# EAGLE design controller (EAGLE 9.6.2)
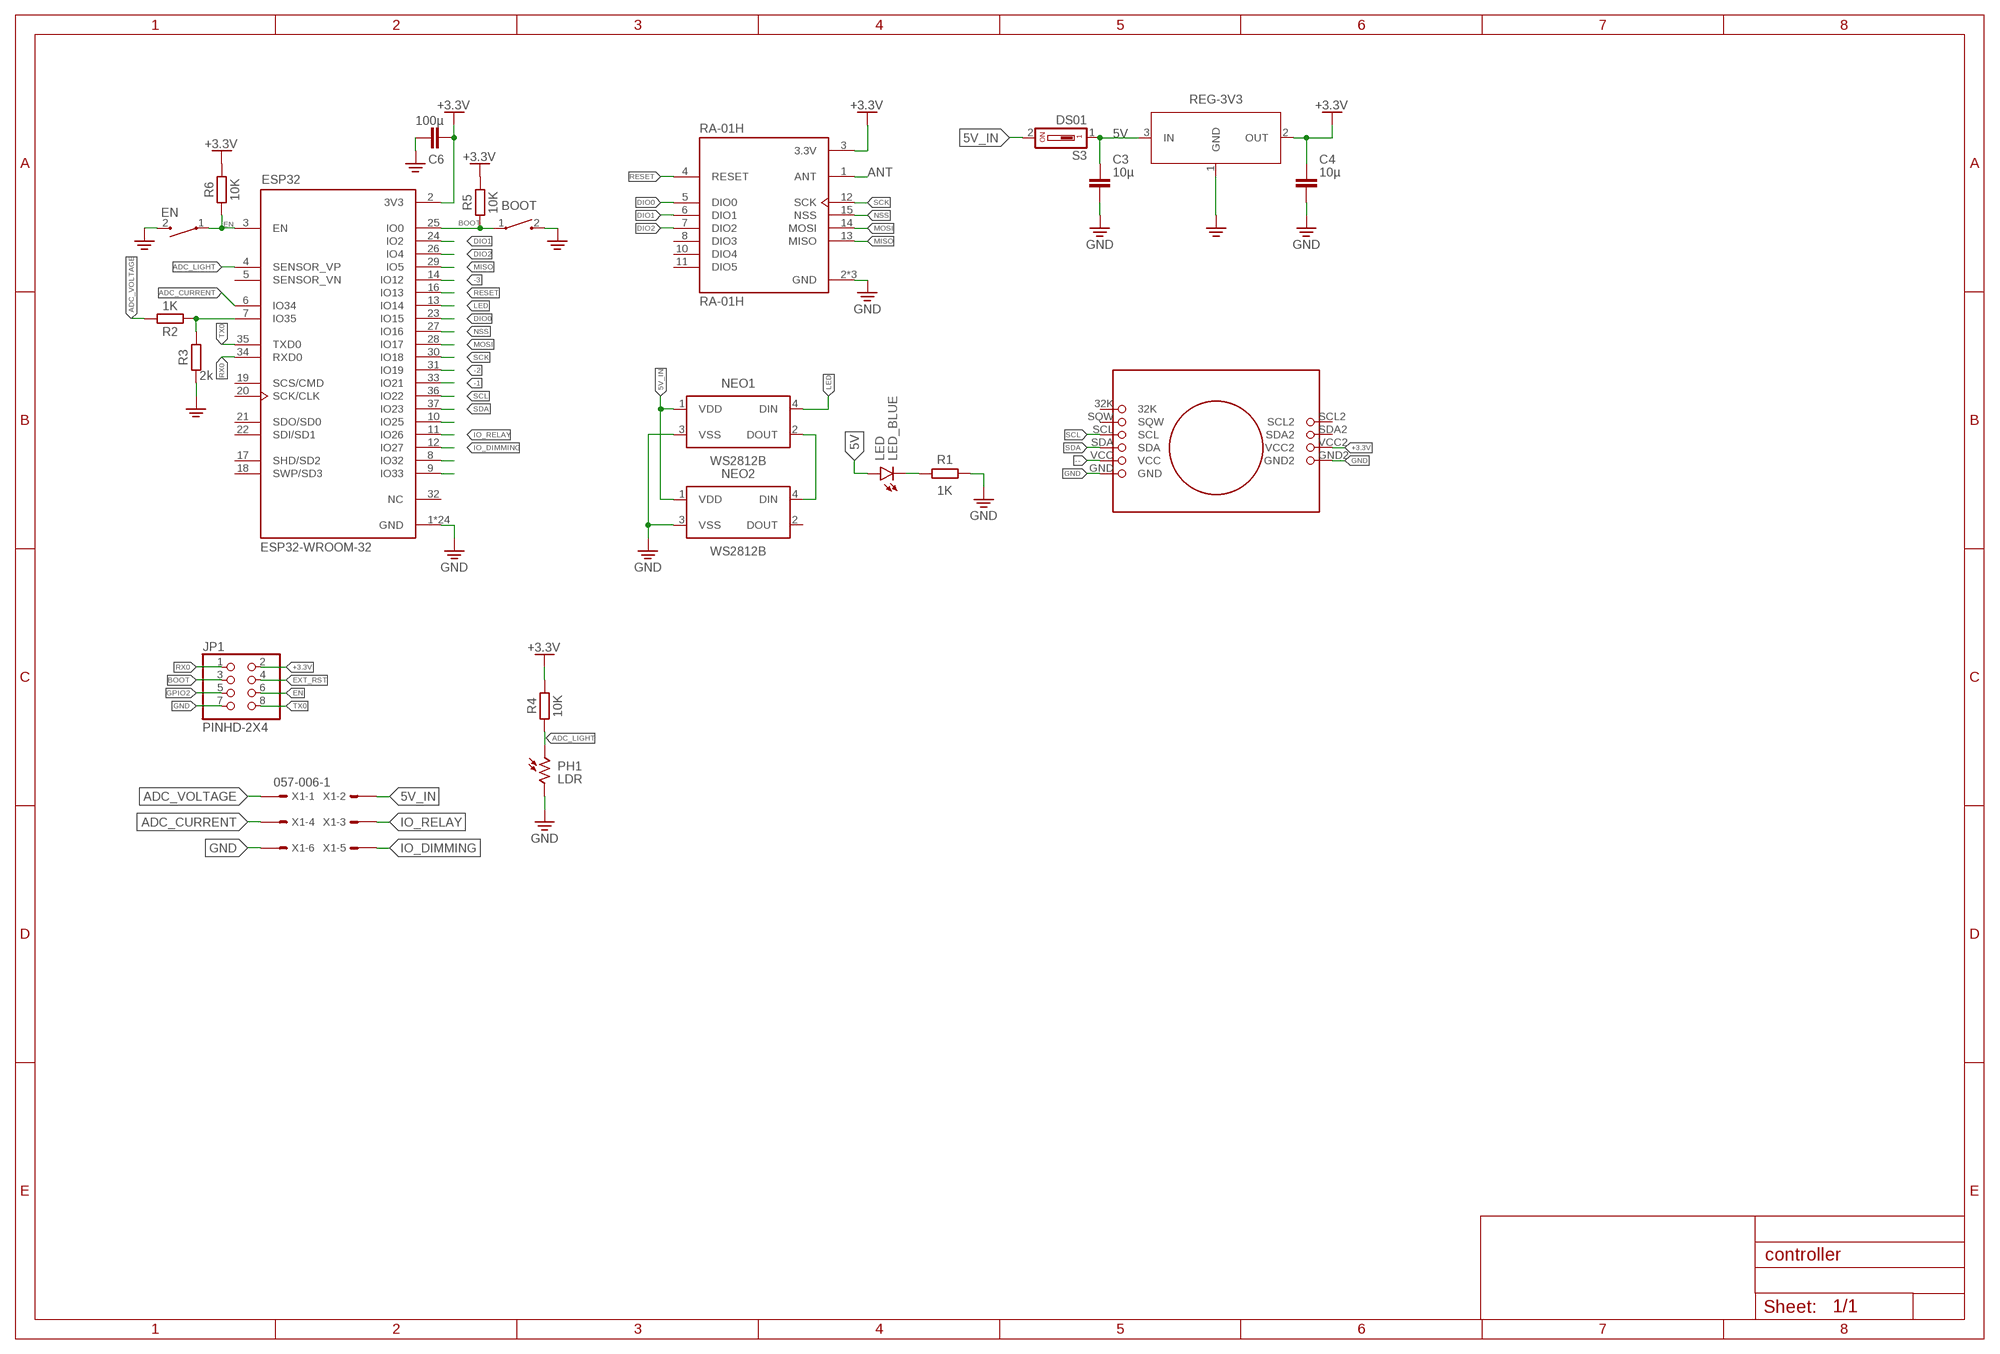
[diagram p0: schematic, sheet 1]

## Parts
BOOT  SWITCH  [SW_1437566-3]
C3  10µ  C_CHIP-0805(2012-METRIC)  [CAPC2012X110]
C4  10µ  C_CHIP-0805(2012-METRIC)  [CAPC2012X110]
C6  100µ  C_TANTALUM-2412(6032-METRIC)  [CAPM6032X280]
EN  SWITCH  [SW_1437566-3]
ESP32  ESP32-WROOM-32  [MODULE_ESP32-WROOM-32]
JP1  PINHD-2X4  [2X04]
LED  LED_BLUE  CHIP-FLAT-B_0805  [LEDC2012X110N_FLAT-B]
NEO1  WS2812B  [WS2812B]
NEO2  WS2812B  [WS2812B]
PH1  LDR  A1050_09  [T0-46-A10XX]
R1  1K  R_CHIP-0805(2012-METRIC)  [RESC2012X65]
R2  1K  R_CHIP-0805(2012-METRIC)  [RESC2012X65]
R3  2k  R_CHIP-0805(2012-METRIC)  [RESC2012X65]
R4  10K  R_CHIP-0603(1608-METRIC)  [RESC1608X60]
R5  10K  R_CHIP-0805(2012-METRIC)  [RESC2012X65]
R6  10K  R_CHIP-0805(2012-METRIC)  [RESC2012X65]
RA-01H  RA-01H  [RA-01H]
REG-3V3  NCP1117ST33T3G  NCP1117ST33T3GSOT-223  [SOT230P700X170-4]
S3  DS01  [DS-01]
U$1  DS3231_MODULE  [DS3231_MODULE]
X1  057-006-1  [057-006-1]

## Nets
5V: C3.1 LED.A REG-3V3.3(IN) S3.1
5V_IN: NEO1.1(VDD) NEO2.1(VDD) S3.2 X1.2
+3.3V: C4.1 C6.1 ESP32.2(3V3) JP1.2 R4.2 R5.2 R6.2 RA-01H.3(3.3V) REG-3V3.2(OUT) U$1.VCC2
-1: ESP32.33(IO21)
-2: ESP32.31(IO19)
-3: ESP32.14(IO12)
--: U$1.VCC
ADC_CURRENT: ESP32.6(IO34) X1.4
ADC_LIGHT: ESP32.4(SENSOR_VP) PH1.1 R4.1
ADC_VOLTAGE: R2.2 X1.1
ANT: RA-01H.1(ANT)
BOOT: BOOT.1 ESP32.25(IO0) JP1.3 R5.1
DIO0: ESP32.23(IO15) RA-01H.5(DIO0)
DIO1: ESP32.24(IO2) RA-01H.6(DIO1)
DIO2: ESP32.26(IO4) RA-01H.7(DIO2)
EN: EN.1 ESP32.3(EN) JP1.6 R6.1
EXT_RST: JP1.4
GND: BOOT.2 C3.2 C4.2 C6.2 EN.2 ESP32.1(GND) ESP32.15(GND) ESP32.38(GND) ESP32.39_1(GND) ESP32.39_2(GND) ESP32.39_3(GND) ESP32.39_4(GND) ESP32.39_5(GND) ESP32.39_6(GND) ESP32.39_7(GND) ESP32.39_8(GND) ESP32.39_9(GND) ESP32.39_10(GND) ESP32.39_11(GND) ESP32.39_12(GND) ESP32.39_13(GND) ESP32.39_14(GND) ESP32.39_15(GND) ESP32.39_16(GND) ESP32.39_17(GND) ESP32.39_18(GND) ESP32.39_19(GND) ESP32.39_20(GND) ESP32.39_21(GND) JP1.7 NEO1.3(VSS) NEO2.3(VSS) PH1.2 R1.2 R3.1 RA-01H.2(GND) RA-01H.9(GND) RA-01H.16(GND) REG-3V3.1(GND) U$1.GND U$1.GND2 X1.6
GPIO2: JP1.5
IO_DIMMING: ESP32.12(IO27) X1.5
IO_RELAY: ESP32.11(IO26) X1.3
LED: ESP32.13(IO14) NEO1.4(DIN)
MISO: ESP32.29(IO5) RA-01H.13(MISO)
MOSI: ESP32.28(IO17) RA-01H.14(MOSI)
N$2: ESP32.7(IO35) R2.1 R3.2
N$14: NEO1.2(DOUT) NEO2.4(DIN)
N$25: LED.C R1.1
N$42: ESP32.10(IO25)
N$45: ESP32.8(IO32)
N$46: ESP32.9(IO33)
NSS: ESP32.27(IO16) RA-01H.15(NSS)
RESET: ESP32.16(IO13) RA-01H.4(RESET)
RX0: ESP32.34(RXD0) JP1.1
SCK: ESP32.30(IO18) RA-01H.12(SCK)
SCL: ESP32.36(IO22) U$1.SCL
SDA: ESP32.37(IO23) U$1.SDA
TX0: ESP32.35(TXD0) JP1.8
Unconnected: ESP32.5(SENSOR_VN) ESP32.17(SHD/SD2) ESP32.18(SWP/SD3) ESP32.19(SCS/CMD) ESP32.20(SCK/CLK) ESP32.21(SDO/SD0) ESP32.22(SDI/SD1) ESP32.32(NC) NEO2.2(DOUT) RA-01H.8(DIO3) RA-01H.10(DIO4) RA-01H.11(DIO5) U$1.32K U$1.SCL2 U$1.SDA2 U$1.SQW

## Library data of the parts
BOOT EN = XLKM#4:SWITCH: Switch Tactile OFF (ON) SPST Rectangular Button Gull Wing 0.05A 12VDC SMD Loose Piece; MANUFACTURER: TE CONNECTIVITY; PARTREV: C2; STANDARD: Manufacturer recommendations
C3 C4 C6 = Capacitor:C: Capacitor - Generic; CATEGORY: Capacitor
ESP32 = XLKM#4:ESP32-WROOM-32; MANUFACTURER: Espressif Systems; MAXIMUM_PACKAGE_HEIGHT: 3.2 mm; PARTREV: 2.9; STANDARD: Manufacturer Recommendations
JP1 = Connector:PINHD-2X4: PIN HEADER; CATEGORY: CONNECTOR; SUB-CATEGORY: PIN-HEADER
LED = LED:CHIP-FLAT-B; CATEGORY: LED; COLOR: BLUE; DESCRIPTION: CHIP LED FLAT; SUB-CATEGORY: CHIP; TYPE: FLAT_TOP
NEO1 NEO2 = LED:WS2812B: Intelligent control LED integrated light source Datasheet <http://cdn.sparkfun.com/datasheets/BreakoutBoards/WS2812B.pdf>; CATEGORY: LED; COLOR: RGB; DESCRIPTION: LED integrated light source; MANUFACTURER: Worldsemi; MPN: WS2812B; OPERATING_TEMP: -25 ℃ to +80℃(TJ); PART_STATUS: Active; SUB_CATEGORY: RGB
PH1 = photo-elements:A10: Sensor Robust Light Sensing Applications Outdoor Light Sensing Application Source: http://optoelectronics.perkinelmer.com/content/Datasheets/DTS_PhotocellsA1050.pdf
R1-R6 = Resistor:R: Resistor Fixed - Generic; CATEGORY: Resistor; SUB-CATEGORY: Fixed
RA-01H = XLKM#4:RA-01H: Ai-Thinker Lora Series Module; MANUFACTURER: AI-Thinker; MAXIMUM_PACKAGE_HEIGHT: 3.4mm; PARTREV: V1.0; STANDARD: Manufacturer Recommendations
REG-3V3 = IC_Power-Management:NCP1117ST33T3G: 1.0 A Low-Dropout Positive Fixed and Adjustable Voltage Regulators Datasheet <https://www.onsemi.com/pub/Collateral/NCP1117-D.PDF>; CATEGORY: IC_Power-Management; MANUFACTURER: ON Semiconductor; MPN: NCP1117ST33T3G; OPERATING_TEMP: 0 to +125 °C; PART_STATUS: Active; ROHS_COMPLIANT: RoHS3 Compliant; SERIES: NCP1117, NCV1117; SUB-CATEGORY: Voltage Regulator; TYPE: Linear
S3 = Switch:DS01: DIL/CODE SWITCH; CATEGORY: SWITCH; TYPE: SPST
U$1 = XLKM#4:DS3231_MODULE
X1 = con-panduit:057-006-: CONNECTOR 6-pin series 057 contact pc board low profile headers; OC_FARNELL: unknown; OC_NEWARK: unknown

## Board
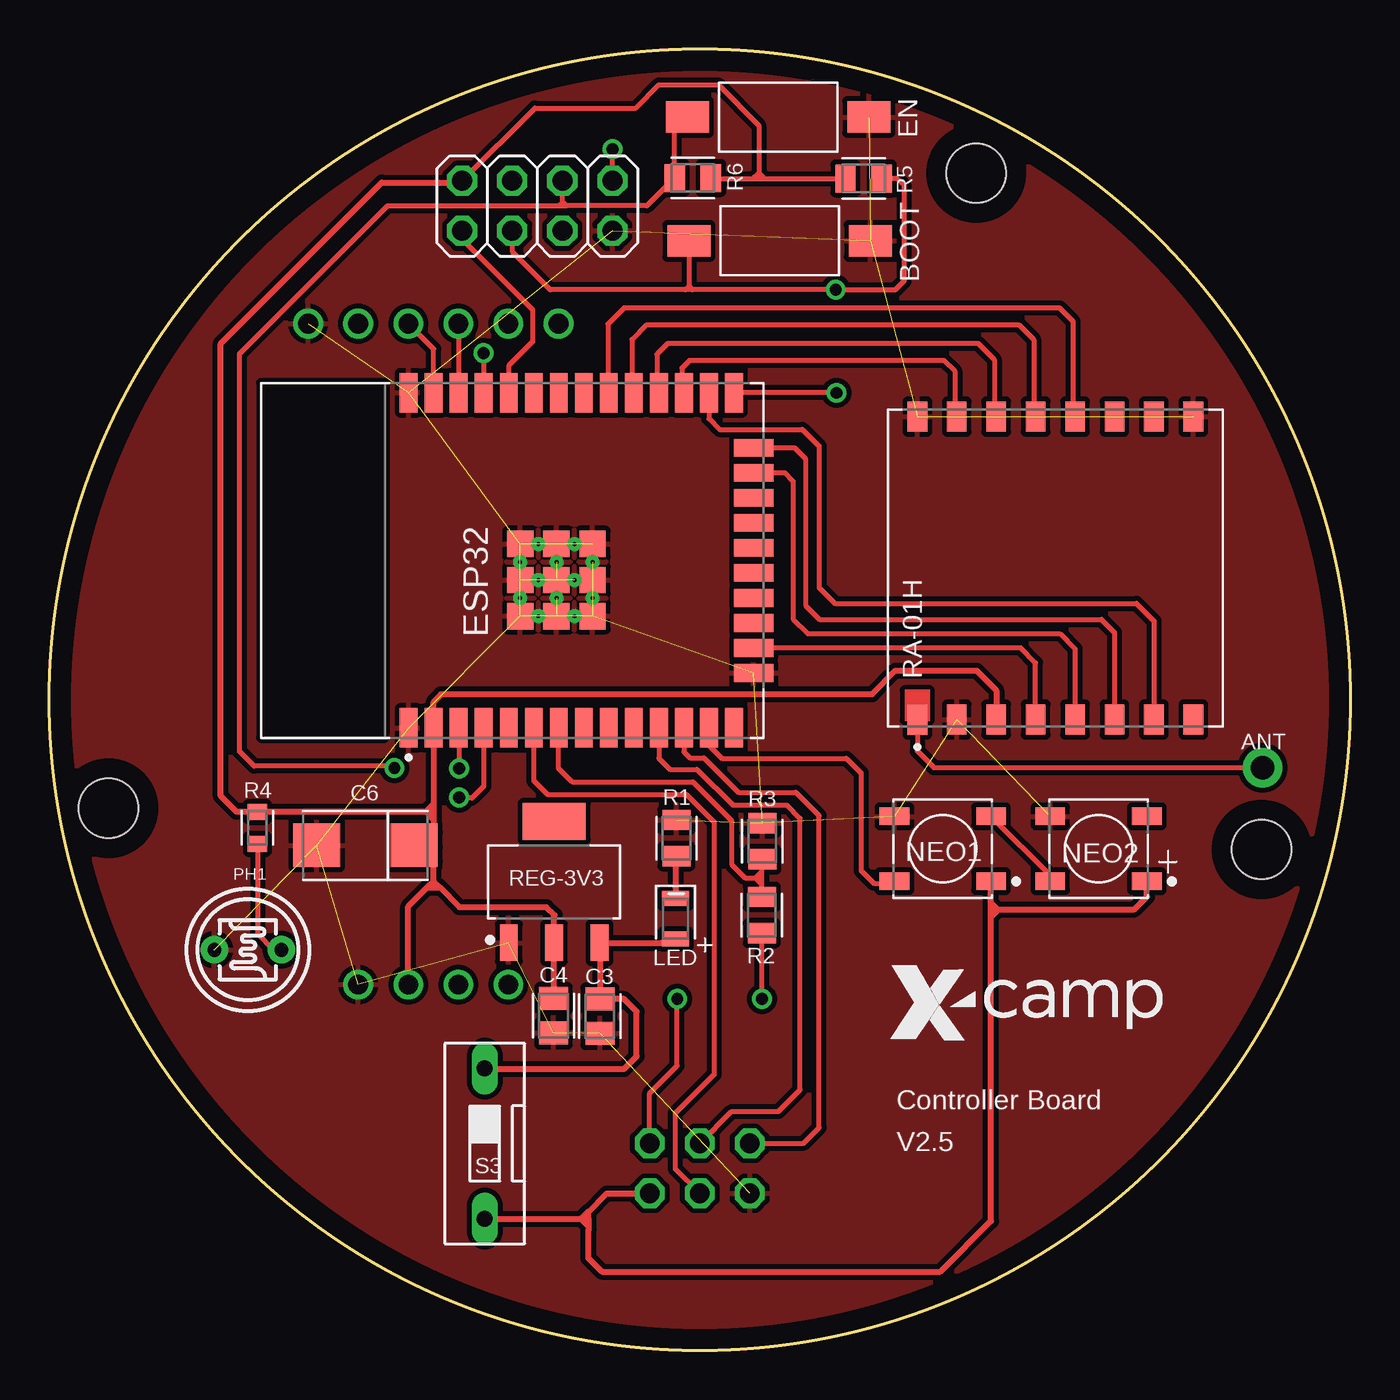
[diagram p1: board, top side]
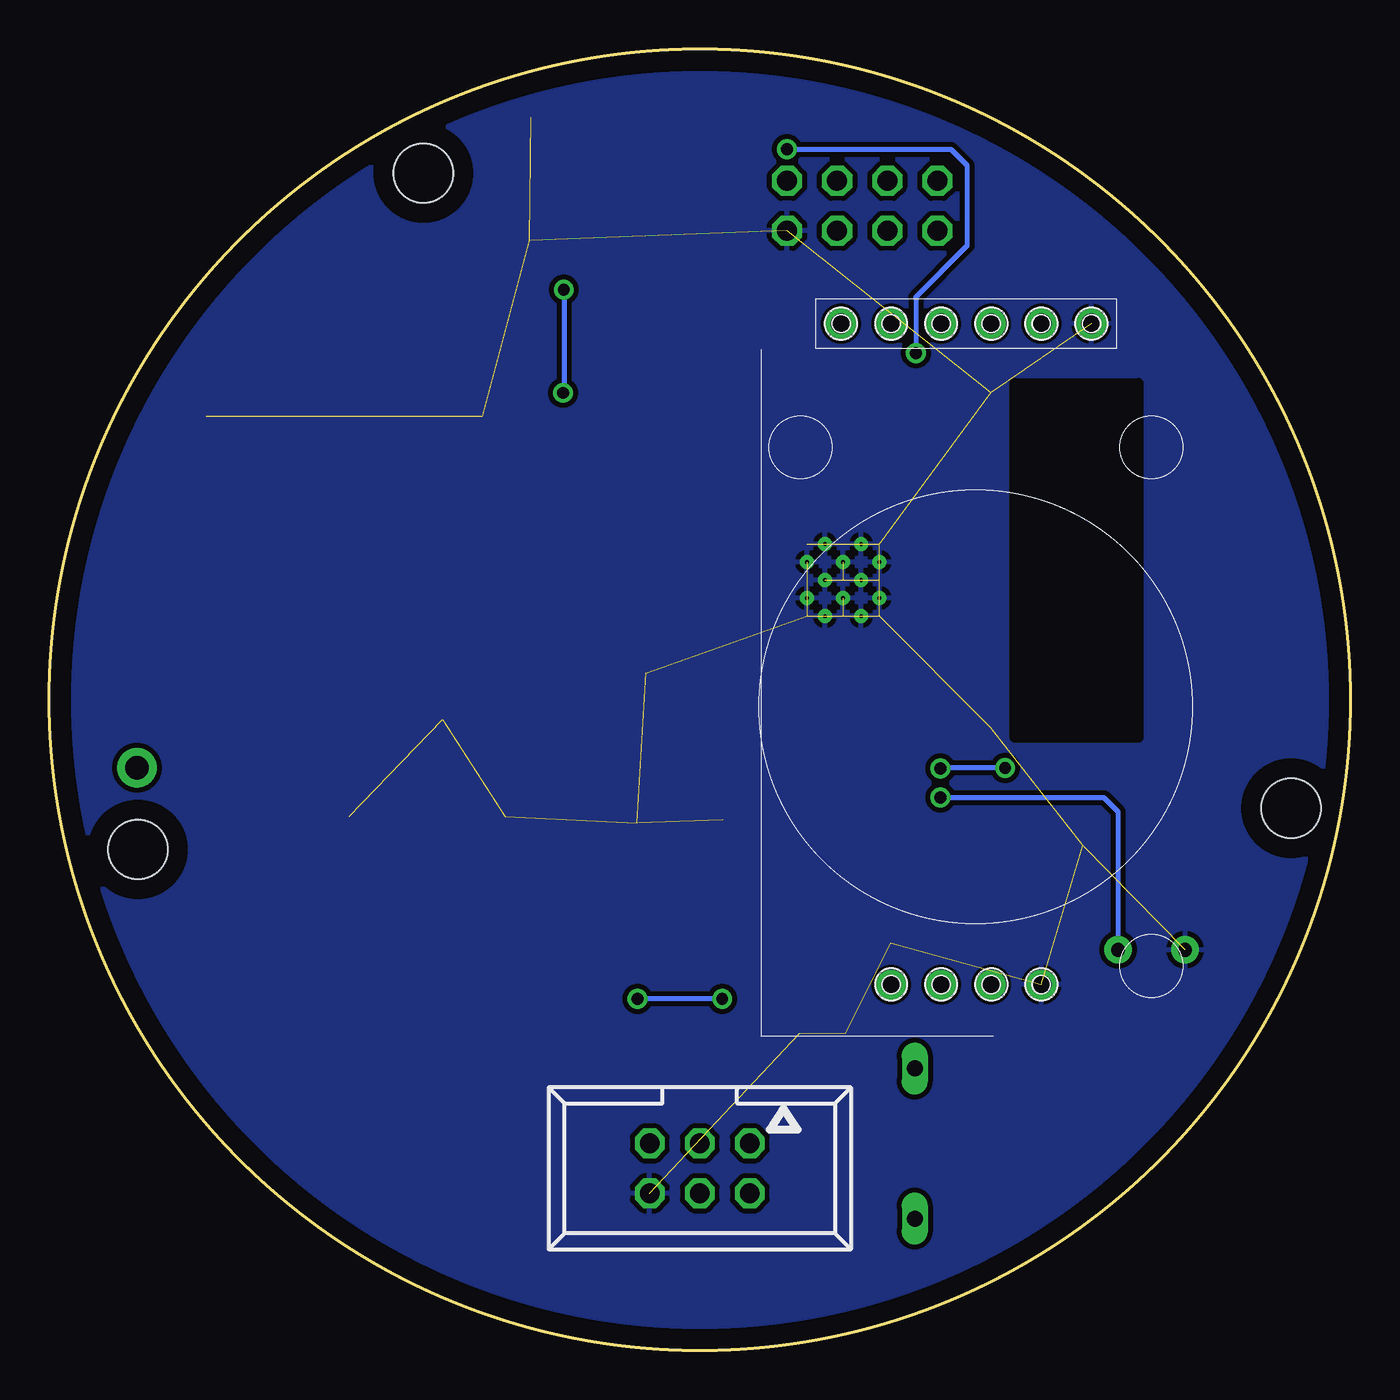
[diagram p2: board, bottom side, seen from below]

Size 66 x 66 mm. Coordinates in mm from the lower left corner, seen from the top.
Outline: circle at 33,33 radius 33
Copper layers (1*16): Top 0.035mm / dielectric 1.5mm / Bottom 0.035mm
Design rules "default *": minimum track width 6mil, minimum drill 0.35mm, track to track 10mil, track to pad 10mil, pad to pad 10mil, via to via 10mil, smd to smd 6mil, copper to edge 40mil, drill to drill 6mil, minimum pad ring 10mil, minimum via ring 8mil, stop-mask expansion 4mil, vias tented up to drill 0mil, thermal gap 10mil
Holes 3 mm at 3,27.5 61.5,25.4 47.02,59.71

### Footprints (pad centres in the part's own frame; a part is rotated, then mirrored left to right if it is on the bottom)
SW_1437566-3 = smd 2.18 x 1.6: 1 -4.6,0; 2 4.6,0
CAPC2012X110 = smd 1.165 x 1.465: 1 -0.875,0; 2 0.875,0
CAPM6032X280 = smd 2.368 x 2.204: 1 -2.471,0; 2 2.471,0
MODULE_ESP32-WROOM-32 = smd 2 x 0.9: 1 -8.5,5.26; 2 -8.5,3.99; 3 -8.5,2.72; 4 -8.5,1.45; 5 -8.5,0.18; 6 -8.5,-1.09; 7 -8.5,-2.36; 8 -8.5,-3.63; 9 -8.5,-4.9; 10 -8.5,-6.17; 11 -8.5,-7.44; 12 -8.5,-8.71; 13 -8.5,-9.98; 14 -8.5,-11.25; 25 8.5,-11.25; 26 8.5,-9.98; 27 8.5,-8.71; 28 8.5,-7.44; 29 8.5,-6.17; 30 8.5,-4.9; 31 8.5,-3.63; 32 8.5,-2.36; 33 8.5,-1.09; 34 8.5,0.18; 35 8.5,1.45; 36 8.5,2.72; 37 8.5,3.99; 38 8.5,5.26 | smd 0.9 x 2: 15 -5.715,-12.25; 16 -4.445,-12.25; 17 -3.175,-12.25; 18 -1.905,-12.25; 19 -0.635,-12.25; 20 0.635,-12.25; 21 1.905,-12.25; 22 3.175,-12.25; 23 4.445,-12.25; 24 5.715,-12.25 | smd 1.33 x 1.33: 39_1 -2.835,-0.405; 39_2 -1,-0.405; 39_3 0.835,-0.405; 39_4 -2.835,-2.24; 39_5 -1,-2.24; 39_6 0.835,-2.24; 39_7 -2.835,-4.075; 39_8 -1,-4.075; 39_9 0.835,-4.075 | drill 0.2 pad 0.3: 39_10 -1.917,-0.405; 39_11 -0.083,-0.405; 39_12 -2.835,-1.323; 39_13 -1,-1.323; 39_14 0.835,-1.323; 39_15 -1.917,-2.24; 39_16 -0.083,-2.24; 39_17 -2.835,-3.158; 39_18 -1,-3.158; 39_19 0.835,-3.158; 39_20 -1.917,-4.075; 39_21 -0.083,-4.075
2X04 = drill 1.016 octagon: 1 -3.81,-1.27; 2 -3.81,1.27; 3 -1.27,-1.27; 4 -1.27,1.27; 5 1.27,-1.27; 6 1.27,1.27; 7 3.81,-1.27; 8 3.81,1.27
LEDC2012X110N_FLAT-B = smd 0.762 x 1.362: A 1.025,0; C -1.025,0
WS2812B = smd 1.5 x 0.9: 1 -2.45,1.65; 2 -2.45,-1.65; 3 2.45,-1.65; 4 2.45,1.65
T0-46-A10XX = drill 0.7 pad 1.4: 1 -1.7,0; 2 1.7,0
RESC2012X65 = smd 1.031 x 1.42: 1 -0.919,0; 2 0.919,0
RESC1608X60 = smd 0.799 x 0.974: 1 -0.815,0; 2 0.815,0
RA-01H = smd 1.536 x 1: 1 -7.682,7; 2 -7.682,5; 3 -7.682,3; 4 -7.682,1; 5 -7.682,-1; 6 -7.682,-3; 7 -7.682,-5; 8 -7.682,-7; 9 7.682,-7; 10 7.682,-5; 11 7.682,-3; 12 7.682,-1; 13 7.682,1; 14 7.682,3; 15 7.682,5; 16 7.682,7
SOT230P700X170-4 = smd 1.86 x 0.898: 1 -3.075,2.3; 2 -3.075,0; 3 -3.075,-2.3 | smd 1.86 x 3.189: 4 3.075,0
DS-01 = drill 0.813 long: 1 0,-3.81; 2 0,3.81
DS3231_MODULE = drill 1: 32K -4.108,36.06; GND -16.808,36.06; GND2 -14.268,2.532; SCL -9.188,36.06; SCL2 -6.648,2.532; SDA -11.728,36.06; SDA2 -9.188,2.532; SQW -6.648,36.06; VCC -14.268,36.06; VCC2 -11.728,2.532
057-006-1 = drill 1 octagon: 1 -2.54,-1.27; 2 -2.54,1.27; 3 0,-1.27; 4 0,1.27; 5 2.54,-1.27; 6 2.54,1.27

### Placement (x,y rotation side)
BOOT  37.05,56.28 0 top
C3  27.93,16.94 270 top
C4  25.58,16.97 270 top
C6  16.04,25.61 180 top
EN  36.98,62.57 0 top
ESP32  23.49,40.07 90 top
JP1  24.76,58.06 0 top
LED  31.77,21.88 270 top
NEO1  45.33,25.44 180 top
NEO2  53.23,25.44 180 top
PH1  10.08,20.31 180 top
R1  31.82,25.98 90 top
R2  36.15,22.08 270 top
R3  36.17,25.82 270 top
R4  10.56,26.5 90 top
R5  41.31,59.45 180 top
R6  32.65,59.47 0 top
RA-01H  51.04,39.68 90 top
REG-3V3  25.61,23.75 90 top
S3  22.09,10.48 180 top
U$1  29.94,16.02 0 top
X1  33,9.23 180 bottom

### Tracks (layer width: path | path; a pad name or v marks a point on that pad's centre or on a via)
5V
  Top 0.152: LED.A 31.58,20.68 31.06,20.68
  Top 0.305: 31.22,20.68 31.06,20.68 REG-3V3.3 27.93,20.66 C3.1 29.17,17.82 29.8,17.19 29.8,14.91 29.15,14.27 22.12,14.27 S3.1
5V_IN
  Top 0.254: 27.35,7.03 27.3,7.03 26.94,6.67 27.35,6.27 27.35,6.09
  Top 0.305: NEO2.1 55.68,23.01 55.02,22.34 48.13,22.34 | S3.2 26.94,6.67 27.32,6.67 27.35,6.7 | 47.78,21.99 47.78,6.55 45.2,3.98 28.03,3.98 27.35,4.67 27.35,6.09 27.35,6.7 | 47.78,21.99 47.78,22.7 | 48.13,22.34 47.78,22.7 | 48.13,22.34 47.78,21.99 | 27.35,6.7 27.35,7.03 28.28,7.96 X1.2 | 47.78,22.7 NEO1.1
+3.3V
  Top 0.152: 19.54,24.81 19.5,24.81
  Top 0.254: JP1.2 24.64,63.02 29.76,63.02 30.93,64.19 33.94,64.19 36,62.13 36,59.72 35.69,59.41 | 35.69,59.41 33.62,59.41 R6.2 | R5.2 40.36,59.41 36.31,59.41 | 36.31,59.41 35.69,59.41 | 36,59.71 36.31,59.41
  Top 0.305: 25.61,22.07 REG-3V3.2 25.61,17.88 C4.1 | 25.61,22.07 25.21,22.48 20.81,22.48 19.81,23.47 | 19.81,23.47 19.5,23.79 | 19.5,23.79 19.5,24.81 | 25.61,22.07 25.64,22.07 | C6.1 19.5,25.53 19.5,26.93 | RA-01H.3 48.04,33.48 47.04,34.48 42.94,34.48 41.74,33.28 19.88,33.28 19.5,32.9 ESP32.2 19.5,27.71 | U$1.VCC2 18.21,22.5 19.18,23.47 | 19.18,23.47 19.5,23.79 | 19.18,23.47 19.81,23.47 | 19.5,27.71 19.5,27.32 | 19.5,27.32 19.5,26.93 | 19.5,27.32 19.11,27.32 | 19.11,27.32 10.57,27.32 R4.2 9.5,27.31 8.7,28.11 8.7,51.07 16.87,59.24 21.11,59.24 21.02,59.33 JP1.2 | 19.11,27.32 19.5,27.71 | 19.11,27.32 19.5,26.93
  Top 0.406: 19.5,24.81 19.5,25.53 | 19.5,26.25 C6.1
ADC_CURRENT
  Top 0.254: ESP32.6 24.58,28.9 25.28,28.2 32.33,28.2 33.72,26.8 33.72,13.99 31.77,12.03 31.77,9.19 X1.4
ADC_LIGHT  (via drill 0.6 pad 1)
  Top 0.254: ESP32.4 22.04,28.6 21.44,28.01 20.82,28.01 v20.8,28.03 | R4.1 10.56,21.14 11.38,20.31 PH1.1
  Bottom 0.254: v20.8,28.03 12.49,28.03 11.78,27.32 PH1.1
ADC_VOLTAGE  (via drill 0.6 pad 1)
  Top 0.254: v36.15,17.82 R2.2 | X1.1 30.46,13.04 31.86,14.43 v31.86,17.82
  Bottom 0.254: v31.86,17.82 v36.15,17.82
ANT  (via drill 1.2 pad 2)
  Top 0.254: RA-01H.1 44.04,30.39 44.87,29.56 v61.55,29.56
BOOT  (via drill 0.6 pad 1)
  Top 0.152: ESP32.25 34.74,49.4
  Top 0.254: JP1.3 23.49,55.73 25.42,53.8 32.26,53.8 | 32.63,53.8 v39.9,53.8 42.92,53.8 43.38,54.26 43.38,59.07 43,59.45 R5.1 | 32.63,53.8 32.26,53.8 | v39.93,48.57 34.82,48.57 34.78,48.53 | BOOT.1 32.45,53.99 | 32.45,53.99 32.45,53.98 32.63,53.8 | 32.26,53.8 32.45,53.99
  Top 0.305: 34.78,48.53 ESP32.25
  Bottom 0.254: v39.9,53.8 39.9,48.61 v39.93,48.57
DIO0
  Top 0.254: ESP32.23 37.3,44.52 37.74,44.08 37.74,37.1 38.48,36.36 51.26,36.36 52.04,35.58 RA-01H.5
DIO1
  Top 0.152: RA-01H.6 54.14,32.1
  Top 0.254: ESP32.24 37.81,45.79 38.37,45.23 38.37,37.78 39.07,37.08 53.38,37.08 54.04,36.42 RA-01H.6
DIO2
  Top 0.254: ESP32.26 33.47,47.25 34,46.72 38.2,46.72 39.05,45.87 39.05,38.69 39.86,37.88 55.15,37.88 56.04,36.99 RA-01H.7
EN  (via drill 0.6 pad 1)
  Top 0.254: 25.84,58.06 17.16,58.06 9.66,50.55 9.66,30.37 10.39,29.63 17.4,29.63 v17.51,29.53 | 25.84,58.06 26.03,58.25 | ESP32.3 20.78,31.56 v20.78,29.52 | 26.22,58.06 30.32,58.06 R6.1 31.73,61.92 EN.1 | 26.22,58.06 26.03,58.25 | 26.03,58.25 JP1.6 | 25.84,58.06 26.22,58.06
  Bottom 0.254: v17.51,29.53 20.77,29.53 v20.78,29.52
GND  (41 unrouted)
  pour Top (isolate 0.254): -0.41,46.6 19.37,66.39 46.65,66.39 66.49,46.55 66.49,19.37 46.8,-0.31 19.16,-0.31 -0.41,19.26
  pour Bottom (isolate 0.254): -0.41,46.56 19.37,66.35 46.65,66.35 66.49,46.51 66.49,19.33 46.8,-0.35 19.16,-0.35 -0.41,19.22
IO_DIMMING
  Top 0.254: ESP32.12 32.2,30.36 32.51,30.05 33.2,30.05 34.96,28.3 37.88,28.3 38.84,27.34 39.06,27.12 39.06,11.28 38.27,10.5 X1.5
IO_RELAY
  Top 0.254: ESP32.11 30.93,30.03 31.49,29.47 32.86,29.47 34.68,27.65 37.42,27.65 38.09,26.98 38.09,13.21 36.99,12.11 34.61,12.11 X1.3
LED
  Top 0.152: 42.78,23.69 NEO1.4 | ESP32.13 33.44,31.54
  Top 0.254: ESP32.13 33.47,30.68 34.12,30.03 40.44,30.03 41.18,29.29 41.18,24.34 41.83,23.69 42.78,23.69
MISO
  Top 0.152: RA-01H.13 49.94,47.46 | 29.56,48.67 ESP32.29
  Top 0.254: 49.94,47.46 49.94,51.27 49.22,51.99 30.27,51.99 29.56,51.28 29.56,48.67
MOSI
  Top 0.152: RA-01H.14 47.94,47.46 | 30.83,48.67 ESP32.28
  Top 0.254: 47.94,47.46 47.94,50.26 47.13,51.07 31.37,51.07 30.83,50.53 30.83,48.67
N$2
  Top 0.254: R2.1 36.15,23.64 | 36.15,23.64 36.15,23.97 | 36.15,23.97 36.15,24.27 | 36.15,24.27 36.15,24.98 R3.2 36.17,24.76 | ESP32.7 25.85,29.51 26.52,28.83 32.66,28.83 34.61,26.88 34.61,24.66 35.3,23.97 35.83,23.97 | 36.15,23.97 35.83,23.97 | 35.83,23.97 36.14,24.27 36.15,24.27 | 35.83,23.97 35.83,23.96 36.15,23.64
N$14
  Top 0.254: NEO1.2 50.78,24.09 NEO2.4
N$25
  Top 0.305: R1.1 31.77,25.01 LED.C
NSS
  Top 0.152: RA-01H.15 45.94,47.46 | 32.1,48.67 ESP32.27
  Top 0.254: 45.94,47.46 45.94,49.67 45.4,50.22 32.48,50.22 32.1,49.83 32.1,48.67
RESET
  Top 0.254: RA-01H.4 50.04,34.87 49.29,35.63 ESP32.16
RX0
  Top 0.254: JP1.1 20.95,56.37 24.53,52.79 24.53,51.16 23.31,49.94 ESP32.34
SCK
  Top 0.152: RA-01H.12 51.94,47.46 | 28.34,48.62 ESP32.30
  Top 0.254: 51.94,47.46 51.94,52.2 51.27,52.88 29.16,52.88 28.34,52.06 28.34,48.62
SCL
  Top 0.254: U$1.SCL 20.77,52.06 ESP32.36
SDA
  Top 0.254: ESP32.37 19.5,50.79 U$1.SDA
TX0  (via drill 0.6 pad 1)
  Top 0.254: 28.57,60.35 JP1.8 28.57,60.91 v28.58,60.93 | v22.04,50.59 ESP32.35
  Bottom 0.254: v28.58,60.93 20.25,60.93 19.44,60.11 19.44,56.02 22.04,53.42 v22.04,50.59

### Text on the board
tPlace: ANT | Controller Board | V2.5